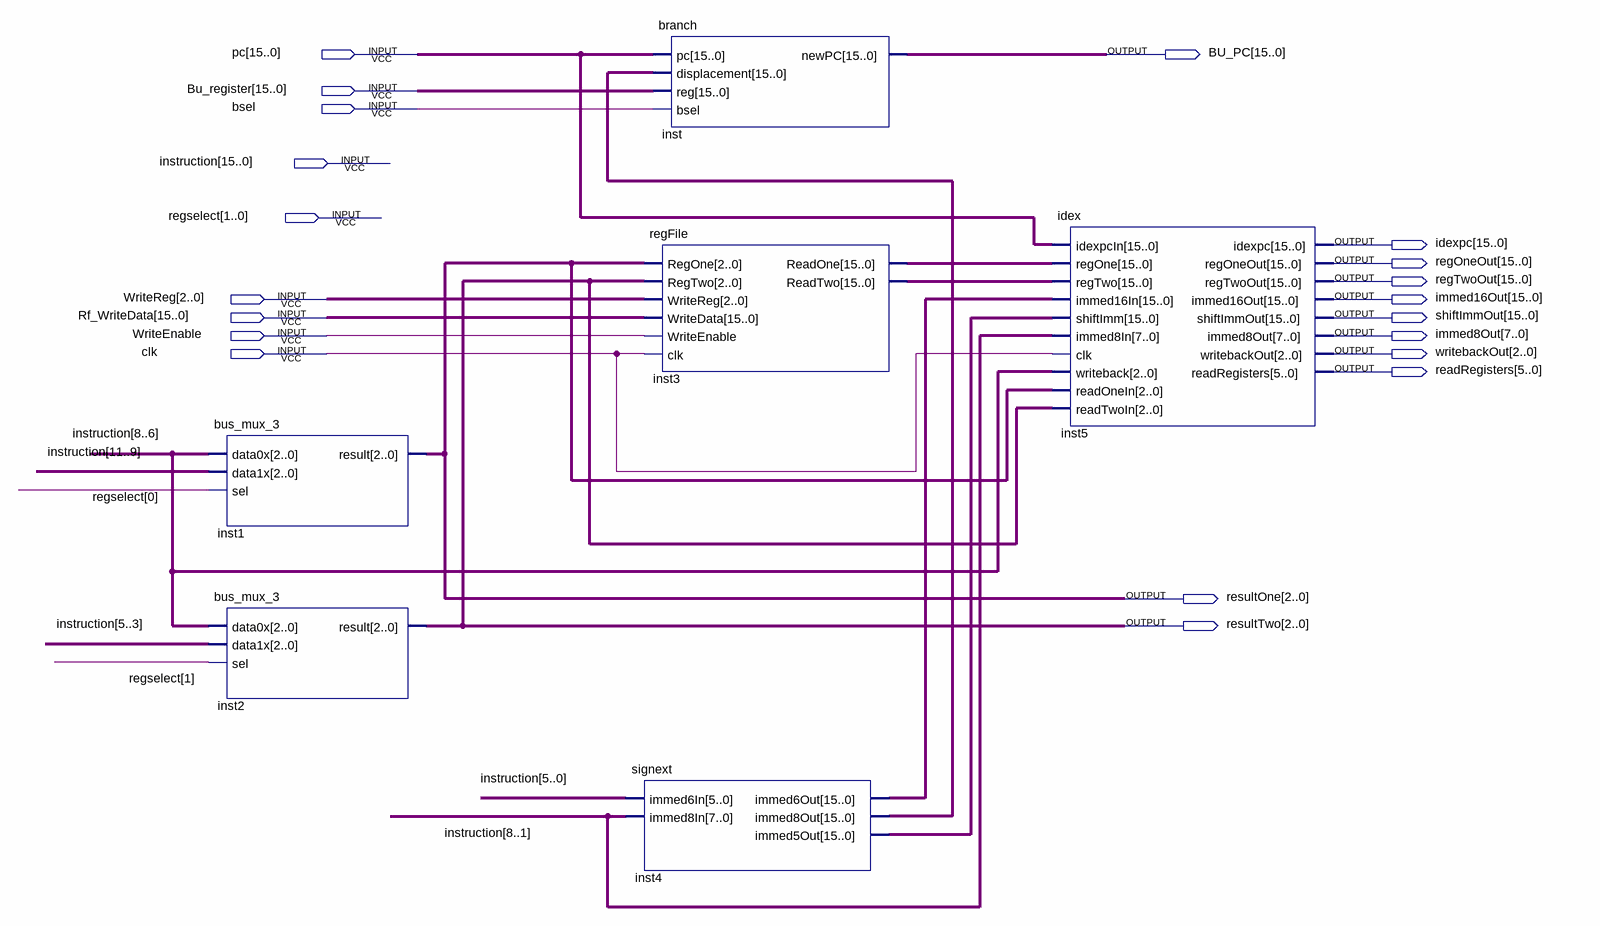
[diagram p0: schematic sheet]
// Quartus schematic stage2.bdf as structural Verilog: 6 symbols, 20 pins
module stage2 (
  input  [15:0] pc,
  input  [15:0] Bu_register,
  input  bsel,
  input  [15:0] instruction,
  input  [1:0] regselect,
  input  [2:0] WriteReg,
  input  [15:0] Rf_WriteData,
  input  WriteEnable,
  input  clk,
  output [15:0] BU_PC,
  output [15:0] idexpc,
  output [15:0] regOneOut,
  output [15:0] regTwoOut,
  output [15:0] immed16Out,
  output [15:0] shiftImmOut,
  output [7:0] immed8Out,
  output [2:0] writebackOut,
  output [5:0] readRegisters,
  output [2:0] resultOne,
  output [2:0] resultTwo
);

  wire [15:0] inst3_readone, inst3_readtwo, inst4_immed5out, inst4_immed6out, inst4_immed8out;

  bus_mux_3 inst1 (.data0x(instruction[8:6]), .data1x(instruction[11:9]), .sel(regselect[0]), .result(resultOne));
  bus_mux_3 inst2 (.data0x(instruction[8:6]), .data1x(instruction[5:3]), .sel(regselect[1]), .result(resultTwo));
  branch inst (.pc(pc), .displacement(inst4_immed8out), .\reg (Bu_register), .bsel(bsel), .newPC(BU_PC));
  regFile inst3 (
    .RegOne(resultOne), .RegTwo(resultTwo), .WriteReg(WriteReg), .WriteData(Rf_WriteData),
    .WriteEnable(WriteEnable), .clk(clk), .ReadOne(inst3_readone), .ReadTwo(inst3_readtwo));
  signext inst4 (
    .immed6In(instruction[5:0]), .immed8In(instruction[8:1]), .immed6Out(inst4_immed6out),
    .immed8Out(inst4_immed8out), .immed5Out(inst4_immed5out));
  idex inst5 (
    .idexpcIn(pc), .regOne(inst3_readone), .regTwo(inst3_readtwo), .immed16In(inst4_immed6out),
    .shiftImm(inst4_immed5out), .immed8In(instruction[8:1]), .clk(clk), .writeback(instruction[8:6]),
    .readOneIn(resultOne), .readTwoIn(resultTwo), .idexpc(idexpc), .regOneOut(regOneOut),
    .regTwoOut(regTwoOut), .immed16Out(immed16Out), .shiftImmOut(shiftImmOut), .immed8Out(immed8Out),
    .writebackOut(writebackOut), .readRegisters(readRegisters));
endmodule
